# EasyEDA Pro project computerFanControllor.eprj

# Schematic Schematic1
Create Date: 2023-01-05; Page Name: P1; Project Name: computerFanControllor; Schematic Name: Schematic1; Update Date: 2023-01-08; Company: 嘉立创EDA; Page Size: A4; Version: V1.0
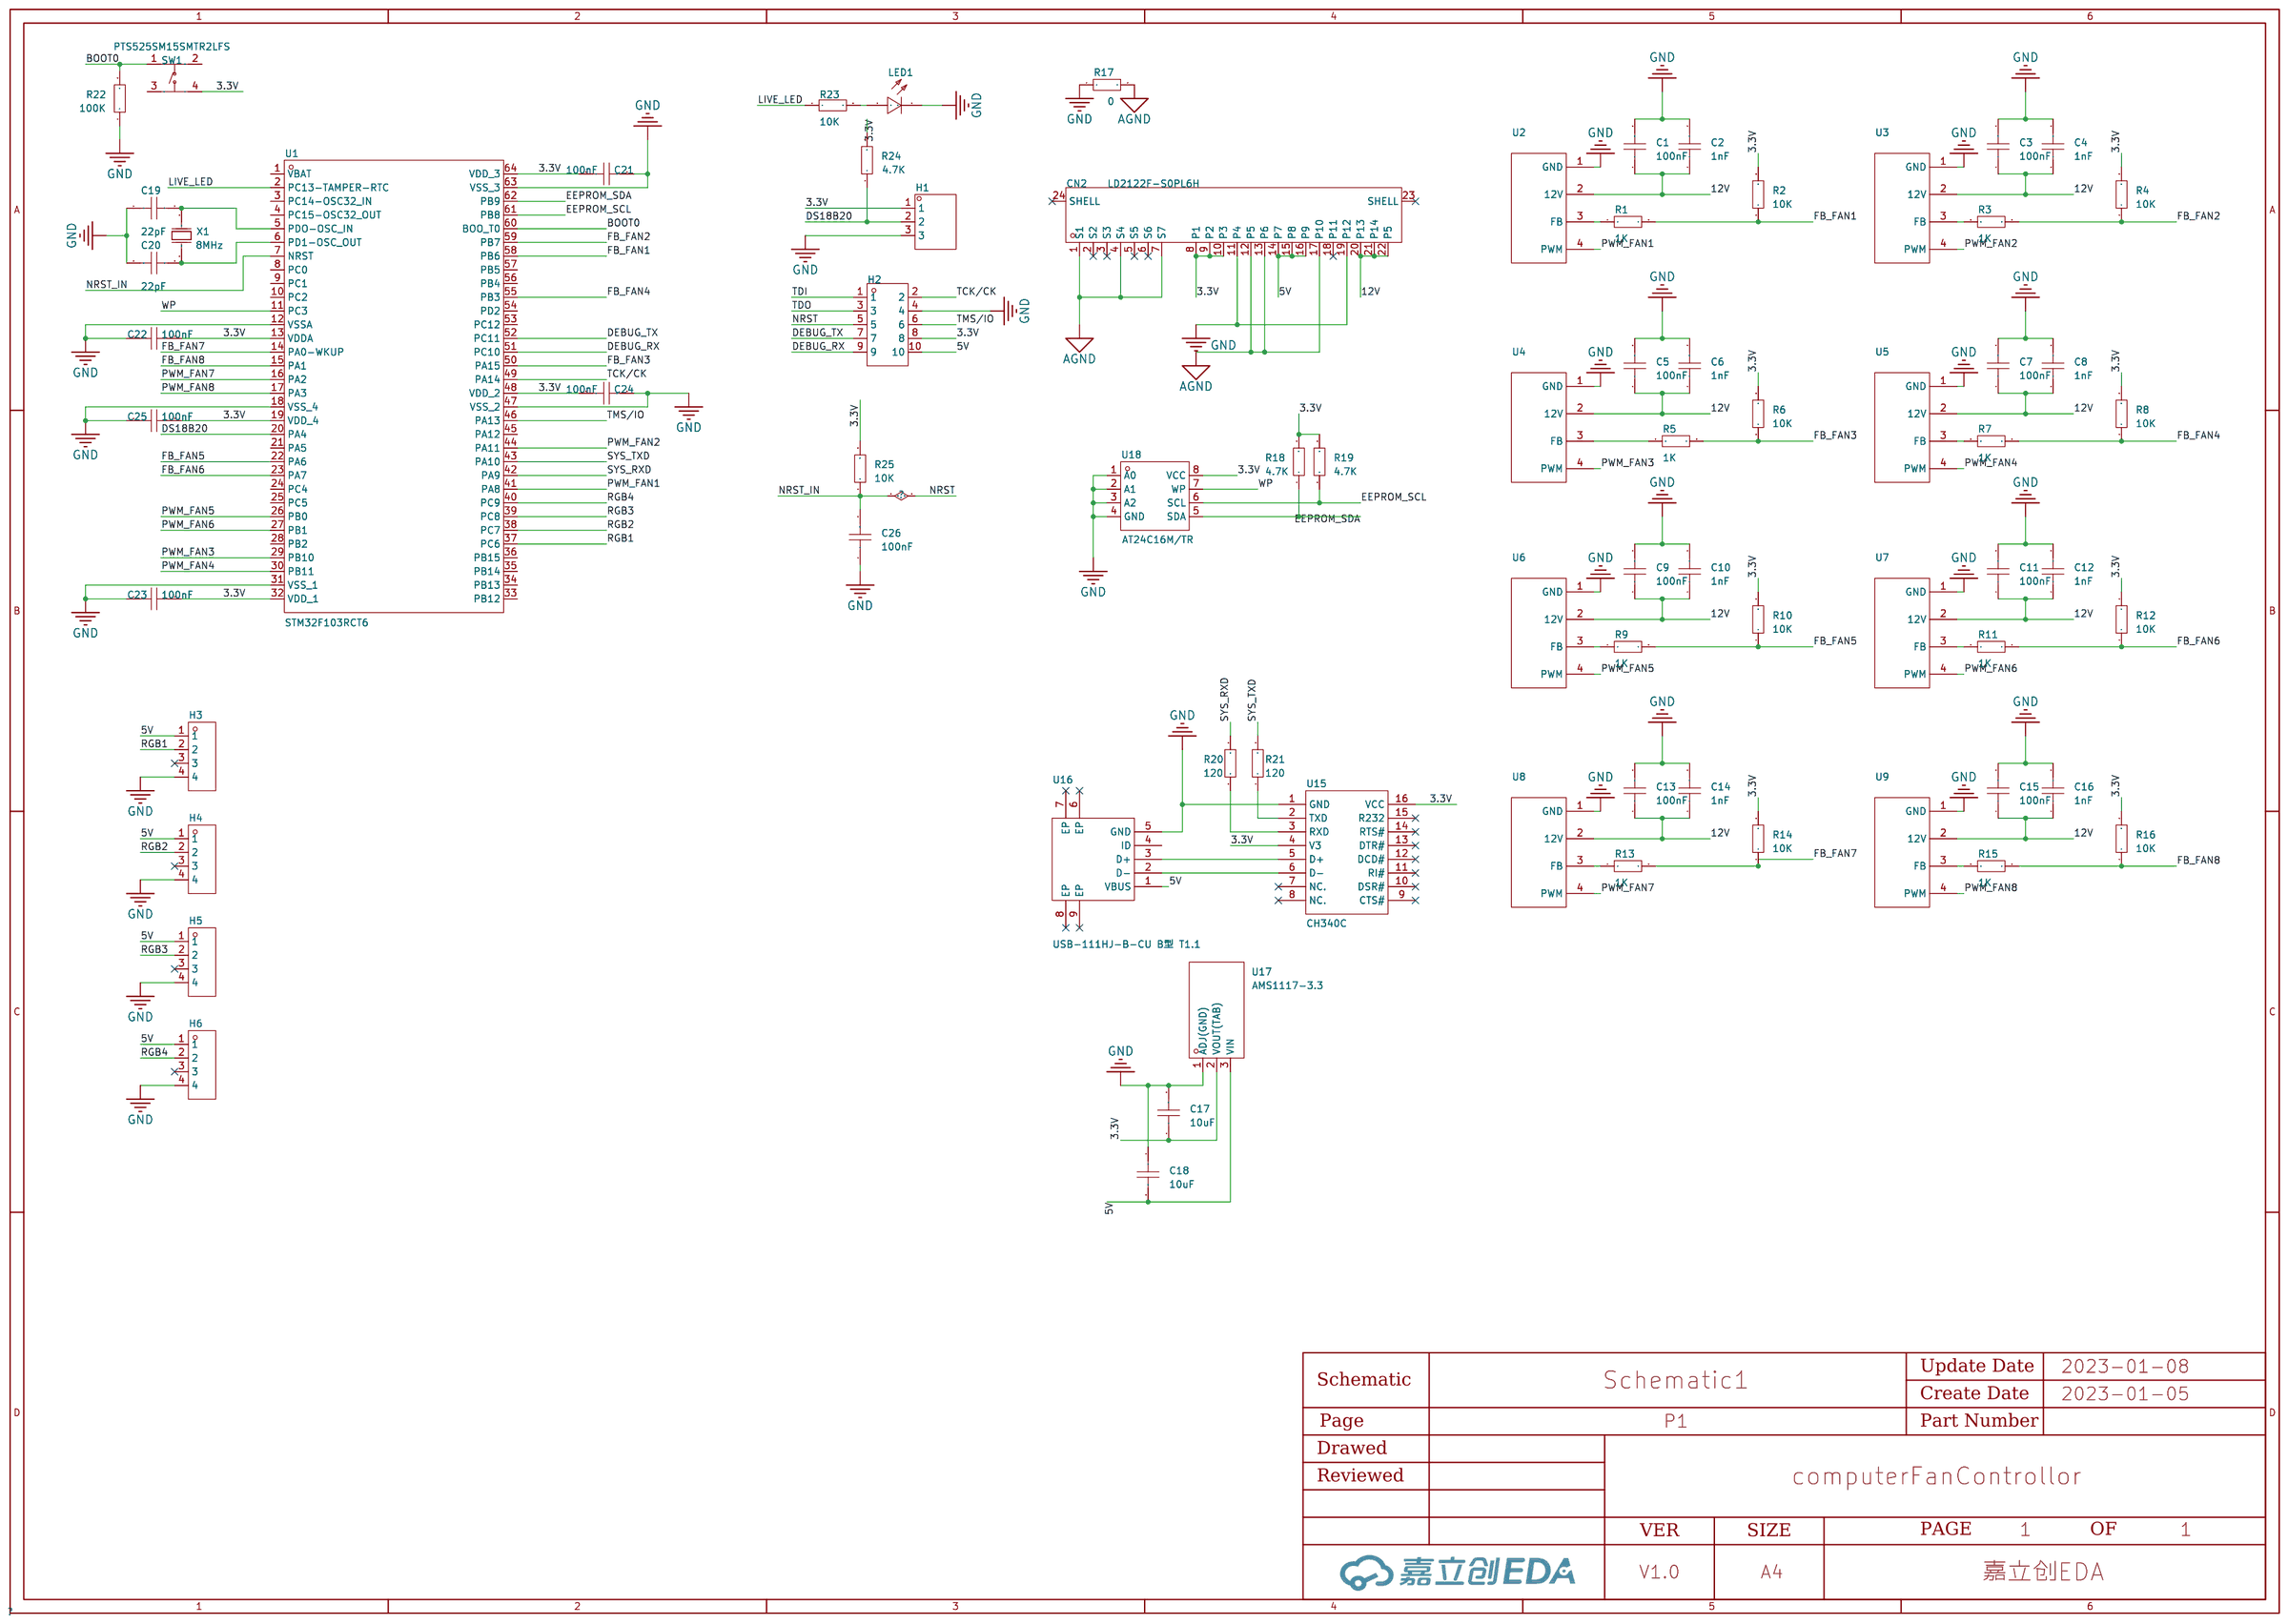
[diagram p0: schematic sheet]

## Parts
C1  100nF  [C0603]
C2  1nF  [C0603]
C3  100nF  [C0603]
C4  1nF  [C0603]
C5  100nF  [C0603]
C6  1nF  [C0603]
C7  100nF  [C0603]
C8  1nF  [C0603]
C9  100nF  [C0603]
C10  1nF  [C0603]
C11  100nF  [C0603]
C12  1nF  [C0603]
C13  100nF  [C0603]
C14  1nF  [C0603]
C15  100nF  [C0603]
C16  1nF  [C0603]
C17  10uF  [C0603]
C18  10uF  [C0603]
C19  22pF  [C0603]
C20  22pF  [C0603]
C21  100nF  [C0603]
C22  100nF  [C0603]
C23  100nF  [C0603]
C24  100nF  [C0603]
C25  100nF  [C0603]
C26  100nF  [C0603]
CN2  LD2122F-S0PL6H  [CONN-SMD_LD2122F-S0PL6H]
H1  77311-102-03LF  [HDR-TH_3P-P2.54-V-M-1]
H2  PZ200-2-05-W  [HDR-TH_10P-P2.00-H-M-R2-C5-S2.00-W9.4-N]
H3  KH-2PH90-1X4P-L10.5  [HDR-TH_4P-P2.00-H-M-W7.2-N]
H4  KH-2PH90-1X4P-L10.5  [HDR-TH_4P-P2.00-H-M-W7.2-N]
H5  KH-2PH90-1X4P-L10.5  [HDR-TH_4P-P2.00-H-M-W7.2-N]
H6  KH-2PH90-1X4P-L10.5  [HDR-TH_4P-P2.00-H-M-W7.2-N]
LED1  19-213/Y2C-CQ2R2L/3T(CY)  [LED0603-R-RD]
R1  1K  [R0603]
R2  10K  [R0603]
R3  1K  [R0603]
R4  10K  [R0603]
R5  1K  [R0603]
R6  10K  [R0603]
R7  1K  [R0603]
R8  10K  [R0603]
R9  1K  [R0603]
R10  10K  [R0603]
R11  1K  [R0603]
R12  10K  [R0603]
R13  1K  [R0603]
R14  10K  [R0603]
R15  1K  [R0603]
R16  10K  [R0603]
R17  0  [R0603]
R18  4.7K  [R0603]
R19  4.7K  [R0603]
R20  120  [R0603]
R21  120  [R0603]
R22  100K  [R0603]
R23  10K  [R0603]
R24  4.7K  [R0603]
R25  10K  [R0603]
SW1  PTS525SM15SMTR2LFS  [KEY-SMD_4P-L5.2-W5.2-P3.80-LS6.2]
U1  STM32F103RCT6  [LQFP-64_L10.0-W10.0-P0.50-LS12.0-BL]
U2  fanConnect  [4Pin风扇接口]
U3  fanConnect  [4Pin风扇接口]
U4  fanConnect  [4Pin风扇接口]
U5  fanConnect  [4Pin风扇接口]
U6  fanConnect  [4Pin风扇接口]
U7  fanConnect  [4Pin风扇接口]
U8  fanConnect  [4Pin风扇接口]
U9  fanConnect  [4Pin风扇接口]
U15  CH340C  [SOP-16_L10.0-W3.9-P1.27-LS6.0-BL]
U16  USB-111HJ-B-CU B型 T1.1  [MICRO-USB-SMD_USB-111HJ]
U17  AMS1117-3.3  [SOT-89_L4.5-W2.5-P1.50-LS4.2-BR]
U18  AT24C16M/TR  [SOP-8_L4.9-W3.9-P1.27-LS6.0-BL]
X1  8MHz  [CRYSTAL-SMD_L11.5-W4.8-LS12.7]

## Library data of the parts
C1-C26 = CAP_0603: Supplier Footprint: 0603
CN2 = LD2122F-S0PL6H: 连接器类型:SATA;间距:1.27mm;引脚总数:22;安装方式:-;工作温度范围:-55℃~+85℃;; LCSC Part Name: SATA 1.27mm P数:22; Supplier Part: C2761452; Manufacturer: FOXCONN(富士康); Supplier Footprint: SMD,P=1.27mm; JLCPCB Part Class: 扩展库; Datasheet: https://atta.szlcsc.com/upload/public/pdf/source/20210616/C2761452_F794E7D3312EF9E45FEB3BC38FC6E199.pdf; Supplier: LCSC; Connector Type: SATA; Pitch: 1.27mm; Number of Pins: 22; Operating Temperature Range: -55℃~+85℃
H1 = 77311-102-03LF: 间距:2.54mm;总PIN位数:-;排数:1;插针结构:-;行距:-;安装类型:直插;圆针/方针:方针;额定电流:-;额定电压:-;配合针长度:-;塑高:2.54mm;触头材质:磷青铜;触头镀层:-;颜色:黑色;; LCSC Part Name: 2.54mm 直插 方针; Supplier Part: C180248; Manufacturer: Amphenol; Supplier Footprint: 直插,P=2.54mm; JLCPCB Part Class: 扩展库; Datasheet: https://atta.szlcsc.com/upload/public/pdf/source/20180329/C180248_62E264527695F7ED58561BB828D45E42.pdf; Supplier: LCSC; Pitch: 2.54mm; Number of Rows: 1; Mounting Type: 直插; Circluar Pins/Square Pins: 方针; Insulation Height: 2.54mm; Contact Material: 磷青铜; Color: 黑色
H2 = PZ200-2-05-W: 排数:双排;总PIN位数:10;间距:2mm;插针结构:2x5P;行距:2mm;安装类型:弯插;圆针/方针:方针;额定电流:1.5A;额定电压:-;配合针长度:4mm;塑高:2mm;端接针长度:-;工作温度范围:-40℃~+105℃;颜色:黑色;; LCSC Part Name: 2mm 2x5P 弯插 方针; Supplier Part: C2906011; Manufacturer: HCTL(华灿天禄); Supplier Footprint: 弯插,P=2mm; JLCPCB Part Class: 扩展库; Datasheet: https://atta.szlcsc.com/upload/public/pdf/source/20211108/98DBA505CA87D832D47F3B9CD8D66D87.pdf; Supplier: LCSC; Number of Rows: 双排; Number of Pins: 10; Pitch: 2mm; Pin Structure: 2x5P; Row Spacing: 2mm; Mounting Type: 弯插; Circluar Pins/Square Pins: 方针; Current Rating (Max): 1.5A; Length of Mating Pin: 4mm; Insulation Height: 2mm; Operating Temperature Range: -40℃~+105℃; Color: 黑色
H3-H6 = KH-2PH90-1X4P-L10.5: 排数:单排;总PIN位数:4;间距:2mm;插针结构:1x4P;行距:-;安装类型:弯插;圆针/方针:方针;额定电流:1.5A;额定电压:-;配合针长度:4mm;塑高:2mm;端接针长度:-;工作温度范围:-40℃~+105℃;颜色:-;; LCSC Part Name: 2mm 1x4P 弯插 方针; Supplier Part: C2938466; Manufacturer: kinghelm(金航标); Supplier Footprint: 弯插,P=2mm; JLCPCB Part Class: 扩展库; Datasheet: https://atta.szlcsc.com/upload/public/pdf/source/20211228/35E289205D7989E3A1EB85130EECF70E.pdf; Supplier: LCSC; Number of Rows: 单排; Number of Pins: 4; Pitch: 2mm; Pin Structure: 1x4P; Mounting Type: 弯插; Circluar Pins/Square Pins: 方针; Current Rating (Max): 1.5A; Length of Mating Pin: 4mm; Insulation Height: 2mm; Operating Temperature Range: -40℃~+105℃
LED1 = 19-213/Y2C-CQ2R2L/3T(CY): 发光颜色:黄灯;二极管配置:-;透镜颜色:无色透明;主波长:585.5nm~591.5nm;峰值波长:591nm;色温:-;测试电流:20mA;功率:60mW;发光角度:120°;安装方式:-;工作温度:-40℃~+85℃;; LCSC Part Name: 黄灯 585.5nm~591.5nm; Supplier Part: C72038; Manufacturer: EVERLIGHT(亿光); Supplier Footprint: 0603; JLCPCB Part Class: 基础库; Datasheet: https://atta.szlcsc.com/upload/public/pdf/source/20160507/1462613613586.pdf; Supplier: LCSC; Emitted Color: 黄灯; Lens Color: 无色透明; Dominant Wavelength: 585.5nm~591.5nm; Peak Wavelength: 591nm; Forward Current: 20mA; Power Dissipation: 60mW; Viewing Angle: 120°; Operating Temperature: -40℃~+85℃
R1-R25 = Res_0603: Supplier Footprint: 0603
SW1 = PTS525SM15SMTR2LFS: 触点电流:20mA;额定电压(DC):15V;电路结构:单刀单掷;安装方式:立贴;按钮形状:圆形按钮;带灯:-;开关长度:5.2mm;开关宽度:5.2mm;开关高度:1.5mm;; Supplier Part: C221856; Manufacturer: C&K; Supplier Footprint: SMD,5.2x5.2x1.5mm; JLCPCB Part Class: 扩展库; Datasheet: https://atta.szlcsc.com/upload/public/pdf/source/20180724/C221856_01736BD75CF757B4331614777C6086B7.pdf; Supplier: LCSC; Contact Current: 20mA; Voltage Rating (DC): 15V; Circuit: 单刀单掷; Mounting Style: 立贴; Actuator Style: 圆形按钮; Switch Length: 5.2mm; Switch Width: 5.2mm; Switch Height: 1.5mm
U1 = STM32F103RCT6: CPU内核:ARM Cortex-M3;CPU最大主频:72MHz;工作电压范围:2V~3.6V;内部振荡器:有;程序 FLASH容量:256K@x8bit;RAM总容量:48KB;EEPROM/数据 FLASH容量:-;GPIO端口数量:51;ADC(单元数/通道数/位数):1@x16ch/12bit;DAC(单元数/通道数/位数):1@x2ch/12bit;外设/功能/协议栈:温度传感器；DMA；看门狗；POR；PWM;工作温度范围:-40℃~+85℃;; LCSC Part Name: ARM Cortex-M3 72MHz 闪存：256K@x8bit RAM：48KB; Supplier Part: C8323; Manufacturer: ST(意法半导体); Supplier Footprint: LQFP-64(10x10); JLCPCB Part Class: 扩展库; Datasheet: https://atta.szlcsc.com/upload/public/pdf/source/20161130/1480498797345.pdf; Supplier: LCSC; CPU Core: ARM Cortex-M3; Maximum Frequency: 72MHz; Supply Voltage Range: 2V~3.6V; Internal Oscillator: 有; Program FLASH Size: 256K@x8bit; RAM Size: 48KB; GPIO Ports Number: 51; ADC (Units/Channels/bits): 1@x16ch/12bit; DAC (Units/Channels/bits): 1@x2ch/12bit; Peripherals / Functions / Protocol Stacks: 温度传感器；DMA；看门狗；POR；PWM; Operating Temperature Range: -40℃~+85℃
U2-U9 = 4pin风扇接口
U15 = CH340C: 应用功能:Transceiver;接口协议:USB 2.0;数据速率:2Mbps;供电电压:3.3V；5V;; Supplier Part: C84681; Manufacturer: WCH(南京沁恒); Supplier Footprint: SOP-16; JLCPCB Part Class: 扩展库; Datasheet: https://atta.szlcsc.com/upload/public/pdf/source/20200819/C84681_ADBED554CE321879DBD6B1D06488689C.pdf; Supplier: LCSC; Applications Function: Transceiver; Protocol: USB 2.0; Data Rate: 2Mbps; Supply Voltage: 3.3V；5V
U16 = USB-111HJ-B-CU B型 T1.1: 连接器类型:Micro-B;标准:-;公母:母座;触点数量:5;端口数量:1;安装方式:卧贴;额定电流 - 电源:-;工作温度范围:-;; LCSC Part Name: Micro-B 母座 卧贴; Supplier Part: C2939567; Manufacturer: HOOYA(皓宇电子); Supplier Footprint: SMD; Datasheet: https://atta.szlcsc.com/upload/public/pdf/source/20220211/7A17012C7321BAFDD991CA56D4ADA811.pdf; Supplier: LCSC; Connector Type: Micro-B; Gender: 母座; Number of Contacts: 5; Number of Ports: 1; Mounting Style: 卧贴
U17 = AMS1117-3.3_C347256: 压降(max):1.3V @ 1A;输出电压(可调):-;静态电流(Iq):-;最大输入电压:18V;输出类型:固定;输出电压(固定):3.3V;; LCSC Part Name: 低压差线性稳压(LDO); Supplier Part: C347256; Manufacturer: UMW(友台半导体); Supplier Footprint: SOT-89; JLCPCB Part Class: 扩展库; Datasheet: https://atta.szlcsc.com/upload/public/pdf/source/20181218/C347256_B950D326C9965069E1D136423D8C1DAA.pdf; Supplier: LCSC
U18 = AT24C16M/TR: Supplier Part: C356701; Manufacturer: HGSEMI(华冠); Supplier Footprint: SOP-8; JLCPCB Part Class: 扩展库; Datasheet: https://atta.szlcsc.com/upload/public/pdf/source/20220714/5A9938374CA1B0C07A427C61968786F5.pdf; Supplier: LCSC
X1 = X49SM8MSD2SC: 晶振类型:49SMD;频率:8MHz;频率公差:±20ppm;频率稳定度:±30ppm;负载电容:20pF;工作温度:-20℃~+70℃;; LCSC Part Name: HC-49SMD 8MHz ±20ppm 20pF; Supplier Part: C12674; Manufacturer: YXC(扬兴晶振); Supplier Footprint: HC-49S-SMD-2P; JLCPCB Part Class: 基础库; Datasheet: https://atta.szlcsc.com/upload/public/pdf/source/20210329/C106809_0E91E60850A780B284B63D653DC40EA4.pdf; Supplier: LCSC; Crystal Type: 49SMD; Frequency Tolerance: ±20ppm; Frequency Stability: ±30ppm; Load Capacitance: 20pF; Operating Temperature: -20℃~+70℃

## Nets
3.3V: C17.1 C21.1 C22.2 C23.2 C24.1 C25.2 CN2.8(P1) CN2.9(P2) CN2.10(P3) H1.1 H2.8 R2.2 R4.2 R6.2 R8.2 R10.2 R12.2 R14.2 R16.2 R18.2 R19.2 R24.2 R25.2 SW1.4 U1.13(VDDA) U1.19(VDD_4) U1.32(VDD_1) U1.48(VDD_2) U1.64(VDD_3) U15.4(V3) U15.16(VCC) U17.2(VOUT(TAB)) U18.8(VCC)
5V: C18.2 CN2.14(P7) CN2.15(P8) CN2.16(P9) H2.10 H3.1 H4.1 H5.1 H6.1 U16.1(VBUS) U17.3(VIN)
12V: C1.1 C2.1 C3.1 C4.1 C5.1 C6.1 C7.1 C8.1 C9.1 C10.1 C11.1 C12.1 C13.1 C14.1 C15.1 C16.1 CN2.20(P13) CN2.21(P14) CN2.22(P5) U2.2(12V) U3.2(12V) U4.2(12V) U5.2(12V) U6.2(12V) U7.2(12V) U8.2(12V) U9.2(12V)
AGND: CN2.1(S1) CN2.4(S4) CN2.7(S7) CN2.12(P5) CN2.13(P6) CN2.17(P10) R17.2
GND: C1.2 C2.2 C3.2 C4.2 C5.2 C6.2 C7.2 C8.2 C9.2 C10.2 C11.2 C12.2 C13.2 C14.2 C15.2 C16.2 C17.2 C18.1 C19.1 C20.1 C21.2 C22.1 C23.1 C24.2 C25.1 C26.1 CN2.11(P4) CN2.19(P12) H1.3 H2.4 H3.4 H4.4 H5.4 H6.4 LED1.2(C) R17.1 R22.1 U1.12(VSSA) U1.18(VSS_4) U1.31(VSS_1) U1.47(VSS_2) U1.63(VSS_3) U2.1(GND) U3.1(GND) U4.1(GND) U5.1(GND) U6.1(GND) U7.1(GND) U8.1(GND) U9.1(GND) U15.1(GND) U16.5(GND) U17.1(ADJ(GND)) U18.1(A0) U18.2(A1) U18.3(A2) U18.4(GND)
BOOT0: R22.2 SW1.1 U1.60(BOO_T0)
DEBUG_RX: H2.9 U1.51(PC10)
DEBUG_TX: H2.7 U1.52(PC11)
DS18B20: H1.2 R24.1 U1.20(PA4)
EEPROM_SCL: R19.1 U1.61(PB8) U18.6(SCL)
EEPROM_SDA: R18.1 U1.62(PB9) U18.5(SDA)
FB_FAN1: R1.2 R2.1 U1.58(PB6)
FB_FAN2: R3.2 R4.1 U1.59(PB7)
FB_FAN3: R5.2 R6.1 U1.50(PA15)
FB_FAN4: R7.2 R8.1 U1.55(PB3)
FB_FAN5: R9.2 R10.1 U1.22(PA6)
FB_FAN6: R11.2 R12.1 U1.23(PA7)
FB_FAN7: R13.2 R14.1 U1.14(PA0-WKUP)
FB_FAN8: R15.2 R16.1 U1.15(PA1)
LIVE_LED: R23.1 U1.2(PC13-TAMPER-RTC)
NRST: C26.2 H2.5 R25.1 U1.7(NRST)
PWM_FAN1: U1.41(PA8) U2.4(PWM)
PWM_FAN2: U1.44(PA11) U3.4(PWM)
PWM_FAN3: U1.29(PB10) U4.4(PWM)
PWM_FAN4: U1.30(PB11) U5.4(PWM)
PWM_FAN5: U1.26(PB0) U6.4(PWM)
PWM_FAN6: U1.27(PB1) U7.4(PWM)
PWM_FAN7: U1.16(PA2) U8.4(PWM)
PWM_FAN8: U1.17(PA3) U9.4(PWM)
RGB1: H3.2 U1.37(PC6)
RGB2: H4.2 U1.38(PC7)
RGB3: H5.2 U1.39(PC8)
RGB4: H6.2 U1.40(PC9)
SYS_RXD: R20.2 U1.42(PA9)
SYS_TXD: R21.2 U1.43(PA10)
TCK/CK: H2.2 U1.49(PA14)
TDI: H2.1
TDO: H2.3
TMS/IO: H2.6 U1.46(PA13)
WP: U1.11(PC3) U18.7(WP)
$1N3735: R1.1 U2.3(FB)
$1N4374: R3.1 U3.3(FB)
$1N5683: R5.1 U4.3(FB)
$1N5690: R7.1 U5.3(FB)
$1N10521: R9.1 U6.3(FB)
$1N10528: R11.1 U7.3(FB)
$1N10535: R13.1 U8.3(FB)
$1N10542: R15.1 U9.3(FB)
$1N19138: U15.5(D+) U16.3(D+)
$1N19241: U15.6(D-) U16.2(D-)
$1N20833: R20.1 U15.3(RXD)
$1N20835: R21.1 U15.2(TXD)
$1N25627: C19.2 U1.5(PDO-OSC_IN) X1.1(OSC1)
$1N25686: C20.2 U1.6(PD1-OSC_OUT) X1.2(OSC2)
$1N30814: LED1.1(A) R23.2

Not connected (* = marked no-connect by the designer): CN2 2(S2)* 3(S3)* 5(S5)* 6(S6)* 18(P11)* 23(SHELL)* 24(SHELL)*; H3 3*; H4 3*; H5 3*; H6 3*; SW1 2 3; U1 1(VBAT) 3(PC14-OSC32_IN) 4(PC15-OSC32_OUT) 8(PC0) 9(PC1) 10(PC2) 21(PA5) 24(PC4) 25(PC5) 28(PB2) 33(PB12) 34(PB13) 35(PB14) 36(PB15) 45(PA12) 53(PC12) 54(PD2) 56(PB4) 57(PB5); U15 7(NC.)* 8(NC.)* 9(CTS#)* 10(DSR#)* 11(RI#)* 12(DCD#)* 13(DTR#)* 14(RTS#)* 15(R232)*; U16 4(ID) 6(EP)* 7(EP)* 8(EP)* 9(EP)*

# Board PCB1
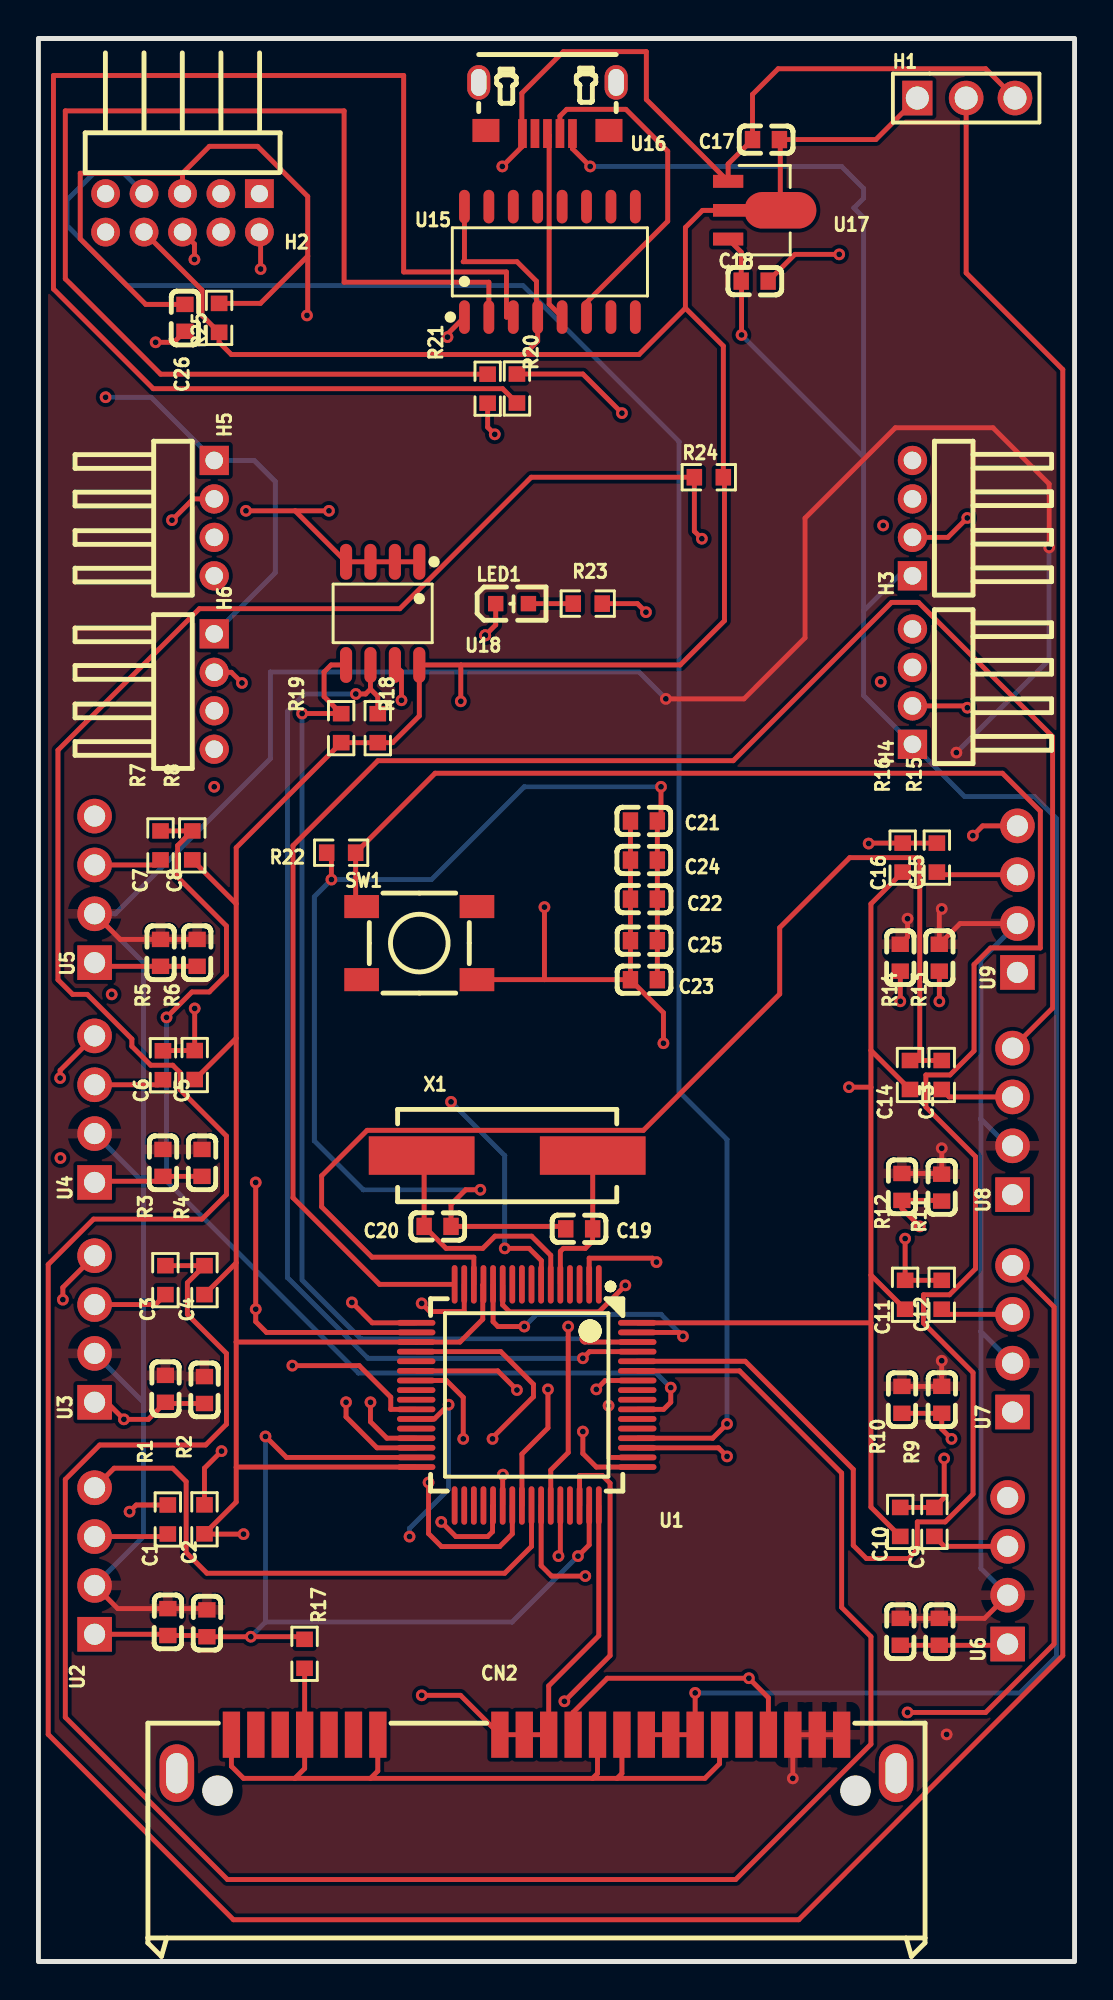
[diagram p1: board, top side]
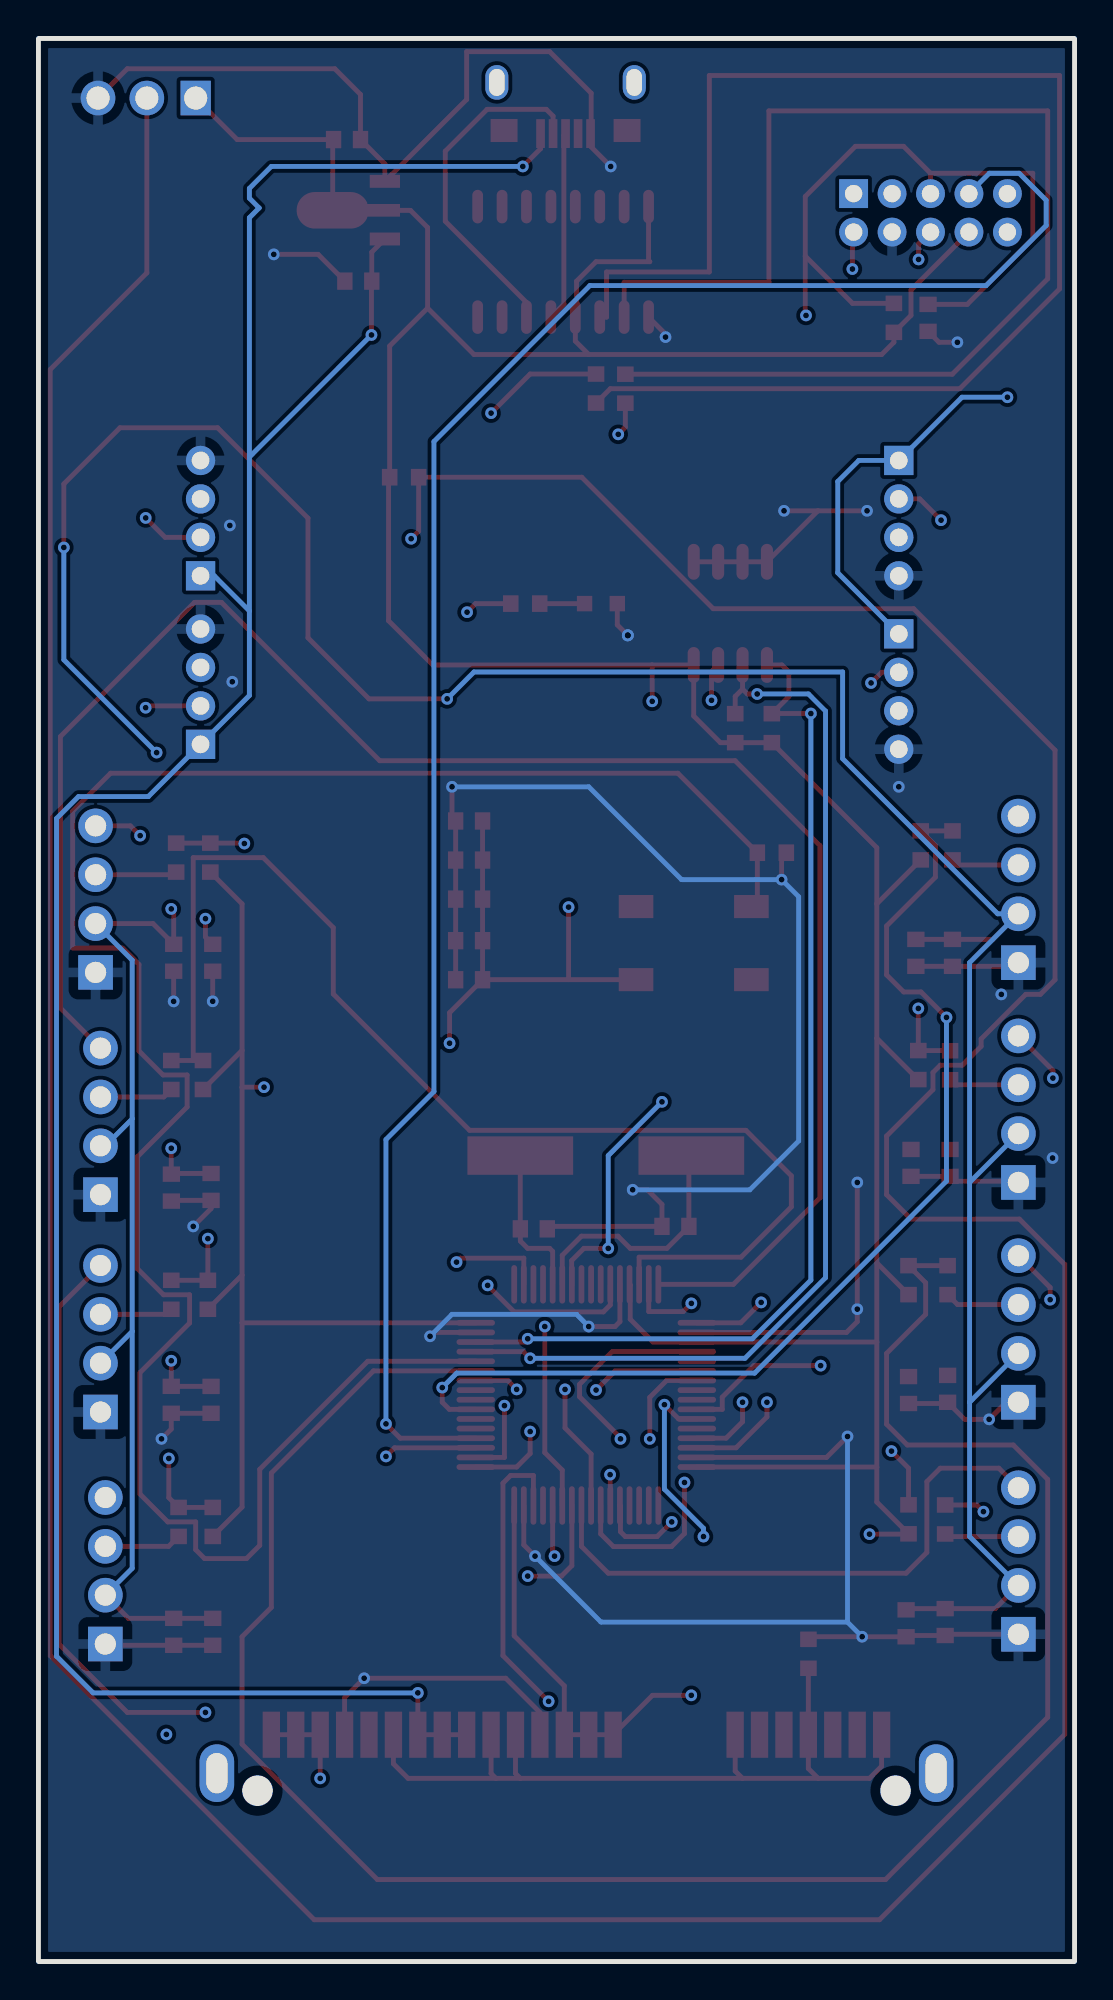
[diagram p2: board, bottom side, seen from below]

Outline 53.9 x 100 mm; copper layers: Top Layer, Inner1, Inner2, Bottom Layer. Coordinates in mm from the lower left corner of the outline.
Outline path: rectangle 0,100 53.9,0
Stack: Top Layer 0.035mm / Dielectric1 0.48mm PP er 4.5 / Inner1 0.035mm / Dielectric2 0.48mm FR4 er 4.5 / Inner2 0.035mm / Dielectric3 0.48mm PP er 4.5 / Bottom Layer 0.035mm

## Design rules (mm)
spacing safeClearance (default): track to track 0.089, other pairs 0.1 to 0.3
track width trackWidth (default): min 0.102, default 0.254, max 2.54
differential pair differentialPair (default): width min 0.127, default 0.254, max 2.54; gap min 0.152, default 0.152
via viaSize (default): diameter min 0.25, default 0.61, max 10; hole min 0.15, default 0.305, max 6

## Placement (name value [footprint] x y rotation side)
C1  100nF  [C0603]  6.73 17.65 270 top
C2  1nF  [C0603]  8.76 17.59 270 top
C3  100nF  [C0603]  6.6 29.78 270 top
C4  1nF  [C0603]  8.64 29.72 270 top
C5  100nF  [C0603]  8.51 41.53 270 top
C6  1nF  [C0603]  6.48 41.53 270 top
C7  100nF  [C0603]  6.35 52.45 270 top
C8  1nF  [C0603]  8.25 52.45 270 top
C9  100nF  [C0603]  46.86 17.15 270 top
C10  1nF  [C0603]  44.83 17.15 270 top
C11  100nF  [C0603]  44.92 29.21 270 top
C12  1nF  [C0603]  46.99 29.21 270 top
C13  100nF  [C0603]  46.98 40.24 270 top
C14  1nF  [C0603]  44.92 40.28 270 top
C15  100nF  [C0603]  46.86 52.2 270 top
C16  1nF  [C0603]  44.83 52.2 270 top
C17  10uF  [C0603]  37.85 94.74 180 top
C18  10uF  [C0603]  37.26 87.38 180 top
C19  22pF  [C0603]  28.13 38.1 0 top
C20  22pF  [C0603]  20.76 38.23 180 top
C21  100nF  [C0603]  31.5 59.31 0 top
C22  100nF  [C0603]  31.5 55.25 180 top
C23  100nF  [C0603]  31.5 51.05 180 top
C24  100nF  [C0603]  31.5 57.28 0 top
C25  100nF  [C0603]  31.5 53.09 180 top
C26  100nF  [C0603]  7.62 85.47 90 top
CN2  LD2122F-S0PL6H  [CONN-SMD_LD2122F-S0PL6H]  25.91 10.8 0 top
H1  77311-102-03LF  [HDR-TH_3P-P2.54-V-M-1]  48.26 96.9 0 top
H2  PZ200-2-05-W  [HDR-TH_10P-P2.00-H-M-R2-C5-S2.00-W9.4-N]  7.49 90.93 180 top
H3  KH-2PH90-1X4P-L10.5  [HDR-TH_4P-P2.00-H-M-W7.2-N]  45.47 75.06 90 top
H4  KH-2PH90-1X4P-L10.5  [HDR-TH_4P-P2.00-H-M-W7.2-N]  45.47 66.29 90 top
H5  KH-2PH90-1X4P-L10.5  [HDR-TH_4P-P2.00-H-M-W7.2-N]  9.14 75.06 270 top
H6  KH-2PH90-1X4P-L10.5  [HDR-TH_4P-P2.00-H-M-W7.2-N]  9.14 66.04 270 top
LED1  19-213/Y2C-CQ2R2L/3T(CY)  [LED0603-R-RD]  24.64 70.61 0 top
R1  1K  [R0603]  6.73 22.99 90 top
R2  10K  [R0603]  8.64 23 270 top
R3  1K  [R0603]  6.6 35.43 90 top
R4  10K  [R0603]  8.64 35.43 270 top
R5  1K  [R0603]  6.48 46.61 90 top
R6  10K  [R0603]  8.13 46.62 270 top
R7  1K  [R0603]  6.35 58.04 90 top
R8  10K  [R0603]  8 58.04 270 top
R9  1K  [R0603]  46.61 22.86 90 top
R10  10K  [R0603]  44.83 22.86 270 top
R11  1K  [R0603]  46.99 34.67 90 top
R12  10K  [R0603]  45.08 34.67 270 top
R13  1K  [R0603]  46.99 46.1 90 top
R14  10K  [R0603]  45.34 46.1 270 top
R15  1K  [R0603]  46.74 57.4 90 top
R16  10K  [R0603]  44.96 57.4 270 top
R17  0  [R0603]  13.84 16 270 top
R18  4.7K  [R0603]  15.75 64.14 270 top
R19  4.7K  [R0603]  17.65 64.14 270 top
R20  120  [R0603]  24.89 81.8 90 top
R21  120  [R0603]  23.37 81.79 270 top
R22  100K  [R0603]  15.75 57.66 0 top
R23  10K  [R0603]  28.58 70.61 180 top
R24  4.7K  [R0603]  34.87 77.18 0 top
R25  10K  [R0603]  9.4 85.47 270 top
SW1  PTS525SM15SMTR2LFS  [KEY-SMD_4P-L5.2-W5.2-P3.80-LS6.2]  19.81 52.96 0 top
U1  STM32F103RCT6  [LQFP-64_L10.0-W10.0-P0.50-LS12.0-BL]  25.4 29.46 180 top
U2  fanConnect  [4Pin风扇接口]  2.92 17.02 90 top
U3  fanConnect  [4Pin风扇接口]  2.92 29.08 90 top
U4  fanConnect  [4Pin风扇接口]  2.92 40.51 90 top
U5  fanConnect  [4Pin风扇接口]  2.92 51.94 90 top
U6  fanConnect  [4Pin风扇接口]  50.42 16.51 90 top
U7  fanConnect  [4Pin风扇接口]  50.67 28.58 90 top
U8  fanConnect  [4Pin风扇接口]  50.67 39.88 90 top
U9  fanConnect  [4Pin风扇接口]  50.93 51.44 90 top
U15  CH340C  [SOP-16_L10.0-W3.9-P1.27-LS6.0-BL]  26.61 88.38 0 top
U16  USB-111HJ-B-CU B型 T1.1  [MICRO-USB-SMD_USB-111HJ]  26.48 96.38 180 top
U17  AMS1117-3.3  [SOT-89_L4.5-W2.5-P1.50-LS4.2-BR]  37.23 91.07 180 top
U18  AT24C16M/TR  [SOP-8_L4.9-W3.9-P1.27-LS6.0-BL]  17.91 70.1 180 top
X1  8MHz  [CRYSTAL-SMD_L11.5-W4.8-LS12.7]  24.38 41.91 180 top

## Footprints (pads in the part's own frame, mm; a bottom-side part is the same pattern mirrored in y, then rotated)
4Pin风扇接口
  rect 1.801x1.801 hole 1.1: 1(0,0)
  round 1.801 hole 1.1: 2(2.54,0) 3(5.08,0) 4(7.62,0)
C0603
  rect 0.8x0.9 smd: 1(-0.7,0) 2(0.7,0)
CONN-SMD_LD2122F-S0PL6H
  rect 0.9x2.4 smd: 1(-15.87,1) 2(-14.6,1) 3(-13.33,1) 4(-12.06,1) 5(-10.79,1) 6(-9.52,1) 7(-8.25,1) 8(-1.905,1) 9(-0.635,1) 10(0.635,1) 11(1.905,1) 12(3.175,1) 13(4.445,1) 14(5.715,1) 15(6.985,1) 16(8.255,1) 17(9.525,1) 18(10.795,1) 19(12.065,1) 20(13.335,1) 21(14.605,1) 22(15.875,1)
  oval 1.8x3 hole 1.1x2.1: 23(-18.71,-1) 24(18.71,-1)
CRYSTAL-SMD_L11.5-W4.8-LS12.7
  rect 5.499x1.999 smd: 1(-4.45,0) 2(4.45,0)
HDR-TH_3P-P2.54-V-M-1
  rect 1.575x1.801 hole 1.199: 1(-2.54,0)
  round 1.801 hole 1.199: 2(0,0) 3(2.54,0)
HDR-TH_4P-P2.00-H-M-W7.2-N
  rect 1.524x1.524 hole 0.914: 1(-3,0)
  round 1.524 hole 0.914: 2(-1,0) 3(1,0) 4(3,0)
HDR-TH_10P-P2.00-H-M-R2-C5-S2.00-W9.4-N
  rect 1.5x1.5 hole 0.9: 1(-4,-1)
  round 1.5 hole 0.9: 2(-4,1) 3(-2,-1) 4(-2,1) 5(0,-1) 6(0,1) 7(2,-1) 8(2,1) 9(4,-1) 10(4,1)
KEY-SMD_4P-L5.2-W5.2-P3.80-LS6.2
  rect 1.8x1.2 smd: 1(-3,1.9) 2(3,1.9) 3(-3,-1.9) 4(3,-1.9)
LED0603-R-RD
  rect 0.8x0.8 smd: 1(0.851,0) 2(-0.851,0)
LQFP-64_L10.0-W10.0-P0.50-LS12.0-BL
  oval 0.3x2 smd: 1(-3.75,-5.75) 2(-3.25,-5.75) 3(-2.75,-5.75) 4(-2.25,-5.75) 5(-1.75,-5.75) 6(-1.25,-5.75) 7(-0.75,-5.75) 8(-0.25,-5.75) 9(0.25,-5.75) 10(0.75,-5.75) 11(1.25,-5.75) 12(1.75,-5.75) 13(2.25,-5.75) 14(2.75,-5.75) 15(3.25,-5.75) 16(3.75,-5.75) 33(3.75,5.75) 34(3.25,5.75) 35(2.75,5.75) 36(2.25,5.75) 37(1.75,5.75) 38(1.25,5.75) 39(0.75,5.75) 40(0.25,5.75) 41(-0.25,5.75) 42(-0.75,5.75) 43(-1.25,5.75) 44(-1.75,5.75) 45(-2.25,5.75) 46(-2.75,5.75) 47(-3.25,5.75) 48(-3.75,5.75)
  oval 2x0.3 smd: 17(5.75,-3.75) 18(5.75,-3.25) 19(5.75,-2.75) 20(5.75,-2.25) 21(5.75,-1.75) 22(5.75,-1.25) 23(5.75,-0.75) 24(5.75,-0.25) 25(5.75,0.25) 26(5.75,0.75) 27(5.75,1.25) 28(5.75,1.75) 29(5.75,2.25) 30(5.75,2.75) 31(5.75,3.25) 32(5.75,3.75) 49(-5.75,3.75) 50(-5.75,3.25) 51(-5.75,2.75) 52(-5.75,2.25) 53(-5.75,1.75) 54(-5.75,1.25) 55(-5.75,0.75) 56(-5.75,0.25) 57(-5.75,-0.25) 58(-5.75,-0.75) 59(-5.75,-1.25) 60(-5.75,-1.75) 61(-5.75,-2.25) 62(-5.75,-2.75) 63(-5.75,-3.25) 64(-5.75,-3.75)
MICRO-USB-SMD_USB-111HJ
  rect 0.45x1.5 smd: 1(-1.3,1.33) 2(-0.65,1.33) 3(0,1.33) 4(0.65,1.33) 5(1.3,1.33)
  rect 1.4x1.2 smd: 6(-3.2,1.17) 7(3.2,1.17)
  oval 1.2x1.8 hole 0.8x1.4: 8(3.575,-1.33) 9(-3.575,-1.33)
R0603
  rect 0.806x0.864 smd: 1(-0.753,0) 2(0.753,0)
SOP-8_L4.9-W3.9-P1.27-LS6.0-BL
  oval 0.63x1.865 smd: 1(-1.905,-2.683) 2(-0.635,-2.683) 3(0.635,-2.683) 4(1.905,-2.683) 5(1.905,2.683) 6(0.635,2.683) 7(-0.635,2.683) 8(-1.905,2.683)
SOP-16_L10.0-W3.9-P1.27-LS6.0-BL
  oval 0.56x1.745 smd: 1(-4.445,-2.873) 2(-3.175,-2.873) 3(-1.905,-2.873) 4(-0.635,-2.873) 5(0.635,-2.873) 6(1.905,-2.873) 7(3.175,-2.873) 8(4.445,-2.873) 9(4.445,2.873) 10(3.175,2.873) 11(1.905,2.873) 12(0.635,2.873) 13(-0.635,2.873) 14(-1.905,2.873) 15(-3.175,2.873) 16(-4.445,2.873)
SOT-89_L4.5-W2.5-P1.50-LS4.2-BR
  rect 1.575x0.673 smd: 1(1.357,-1.498) 3(1.357,1.501)
  custom 5.378x1.9 smd: 2(-1.357,0.007)

## Nets
As in the schematic.

Pads without a net: CN2 2 3 5 6 18 23 24; H3 3; H4 3; H5 3; H6 3; SW1 2 3; U1 1 3 4 8 9 10 21 24 25 28 33 34 35 36 45 53 54 56 57; U15 7 8 9 10 11 12 13 14 15; U16 4 6 7 8 9

## Via types
v1: diameter 0.61, hole 0.305, Top Layer to Bottom Layer, 104 vias

## Routing (per net, layer and track width the routed paths; a pad name or vN(x,y) marks a point on that pad's centre or on a via; arc(x,y) is an arc through that point)
3.3V: length 322.6
  Top Layer w0.254: v1(42.16,45.47) 43.3,45.47 43.31,45.46 ; 43.31,35.7 R12.2 ; 43.31,35.7 43.31,33.21 ; 43.31,35.7 43.31,45.46 ; 10.29,25.7 10.29,23.89 R2.2 8.65,22.22 v1(10.67,22.22) ; 10.29,25.7 10.3,25.71 U1.32 ; 10.29,25.7 10.29,32.21 ; 38.61,94.74 43.56,94.74 45.72,96.9 ; 38.61,94.74 38.55,94.74 ; 38.61,94.74 38.59,94.73 U17.2 38.59,91.06 34.54,91.06 33.65,90.17 33.65,85.98 ; C23.2 30.79,51.06 26.32,51.06 ; C23.2 C25.2 C22.2 C24.1 C21.1 ; C23.2 32.51,49.34 v1(32.51,47.75) ; R8.2 10.29,55 ; 10.29,55 10.29,57.92 R18.2 R19.2 18.42,63.38 19.81,64.77 U18.8 21.99,67.42 ; 10.29,55 10.29,48.01 ; 10.29,32.21 10.29,32.21 U1.19 21.93,32.21 23.11,33.4 23.11,35.18 U1.13 ; 10.29,32.21 10.29,36.33 ; SW1.4 26.32,51.06 ; 26.32,51.06 v1(26.32,54.83) ; 25.27,83.57 31.24,83.57 33.65,85.98 ; 25.27,83.57 25.97,84.26 U15.4 25.91,85.57 25.91,87.38 24.89,88.39 22.1,88.39 22.16,88.45 U15.16 ; 25.27,83.57 10.03,83.57 9.4,84.2 R25.2 9.39,84.72 8.51,85.6 8.51,86.92 H2.8 ; 21.99,67.42 33.39,67.42 35.69,69.72 35.69,77.12 R24.2 35.63,84.01 33.65,85.98 ; 21.99,67.42 21.97,67.41 v1(21.97,65.53) ; U1.64 43.3,33.21 43.31,33.21 ; 8.13,45.86 8.14,45.86 10.29,48.01 ; 10.29,36.33 R4.2 ; 10.29,36.33 10.29,48.01 ; 43.31,47.38 43.31,55 R16.2 ; 43.31,47.38 43.31,45.46 ; 43.31,47.38 R14.2 ; 43.31,33.21 43.31,23.63 R10.2 ; U1.48 29.15,16.94 26.54,14.34 CN2.10 CN2.9 CN2.8 21.95,13.84 v1(19.94,13.84)
  Inner1 w0.254: v1(26.32,54.83) 26.32,61.18 v1(21.97,65.53) ; v1(32.51,47.75) 34.8,45.47 v1(42.16,45.47)
  Inner2 w0.254: v1(10.67,22.22) 11.56,22.22 v1(19.94,13.84)
5V: length 198.7
  Top Layer w0.254: v1(34.16,13.97) CN2.16 CN2.15 CN2.14 ; U16.1 27.78,94.27 v1(28.7,93.34) ; 35.88,89.57 36.56,88.89 C18.2 36.58,87.36 v1(36.58,84.58)
  Inner1 w0.254: H5.1 9.14,82.68 12.95,86.49 15.37,86.49 21.34,92.46 27.81,92.46 v1(28.7,93.34)
  Inner2 w0.254: H2.10 v1(3.49,81.34)
  Bottom Layer w0.254: 42.93,78.23 v1(36.58,84.58) ; 42.93,78.23 42.93,90.68 42.42,91.19 42.93,91.69 42.93,92.2 41.78,93.34 v1(28.7,93.34) ; 42.93,78.23 42.93,70.23 ; v1(34.16,13.97) 51.05,13.97 52.96,15.88 52.96,59.44 51.82,60.58 48.18,60.58 H4.1 42.93,65.83 42.93,70.23 ; v1(3.49,81.34) 5.86,81.34 H5.1 11.22,78.06 12.32,76.96 12.32,72.22 H6.1 ; 42.93,70.23 44.75,72.06 H3.1
12V: length 247.9
  Top Layer w0.254: C11.1 46.99,29.91 ; 46.99,29.91 C12.1 ; 46.99,29.91 46.99,31.24 v1(46.99,31.24) ; v1(46.99,42.29) 46.99,40.95 C13.1 46.95,40.98 C14.1 ; v1(46.99,54.74) 46.86,54.61 C15.1 47.94,53.98 U9.2 ; C2.1 8.7,18.35 C1.1 4.13,18.35 2.92,19.56 ; v1(39.24,9.53) CN2.20 CN2.21 CN2.22 ; v1(52.58,73.53) 52.58,76.84 49.66,79.76 44.58,79.76 39.88,75.06 39.88,68.83 36.7,65.66 v1(32.64,65.66) ; v1(45.21,54.23) 45.21,53.28 C16.1 ; U6.2 49.21,17.84 C9.1 C10.1 ; C8.1 C7.1 4.25,53.15 U5.2
  Inner1 w0.254: v1(45.21,54.23) 46.48,54.23 v1(46.99,54.74) ; v1(39.24,9.53) 41.4,9.53 43.69,11.81 v1(47.24,11.81)
  Inner2 w0.254: U7.2 50.55,31.24 v1(46.99,31.24) ; U8.2 50.55,42.29 v1(46.99,42.29) ; U9.2 47.75,57.15 v1(47.75,62.87) ; v1(47.24,11.81) 50.04,11.81 52.07,13.84 52.07,17.4 U6.2
  Bottom Layer w0.254: 5.46,29.08 5.46,22.1 2.92,19.56 ; 5.46,29.08 5.46,40.51 ; 5.46,29.08 U3.2 ; v1(32.64,65.66) 31.24,67.06 12.06,67.06 12.06,62.55 4,54.48 U5.2 5.46,51.94 5.46,40.51 ; U8.2 50.42,42.42 49.02,43.82 ; 5.46,40.51 U4.2 ; 49.02,43.82 49.02,52.07 U9.2 ; 49.02,43.82 49.02,32.77 ; U6.2 49.02,20.45 49.02,32.77 ; 49.02,32.77 U7.2 ; v1(52.58,73.53) 52.58,67.69 v1(47.75,62.87)
AGND: length 42.2
  Top Layer w0.254: 13.33,9.53 10.67,9.53 10.04,10.16 CN2.1 ; 13.33,9.53 13.85,10.04 CN2.4 13.85,15.24 R17.2 ; 13.33,9.53 17.27,9.53 ; 28.83,9.53 29.08,9.78 CN2.12 ; 28.83,9.53 30.1,9.53 ; 28.83,9.53 17.27,9.53 ; 17.27,9.53 17.65,9.91 17.65,11.79 CN2.7 ; 30.1,9.53 30.35,9.78 CN2.13 ; 30.1,9.53 34.67,9.53 35.43,10.29 CN2.17
GND: length 339
  Top Layer w0.254: v1(24.13,93.34) 25.18,94.39 U16.5 25.15,95.09 25.15,97.16 27.3,99.31 31.62,99.31 31.62,96.83 35.88,92.57 35.88,93.47 C17.2 37.15,97.09 38.48,98.43 49.28,98.43 H1.3 ; v1(33.53,32.51) 33.33,32.71 U1.63 ; U3.1 3.56,29.08 v1(4.45,28.19) 5.72,28.19 C3.2 6.67,29.02 C4.2 ; C16.2 44.83,51.49 v1(44.83,49.93) ; 2.97,40.56 2.98,40.58 ; 2.97,40.56 2.92,40.54 2.89,40.58 2.98,40.58 ; 2.97,40.56 U4.1 ; 2.98,40.58 6.22,40.58 C6.2 C5.2 ; 13.35,75.44 v1(10.8,75.44) ; 13.35,75.44 U18.4 U18.3 U18.2 U18.1 ; 13.35,75.44 v1(15.11,75.44) ; v1(21.28,84.47) 21.28,84.63 U15.1 ; R17.1 13.71,16.89 v1(11.05,16.89) 11.05,16.89 C2.2 8.7,16.95 C1.2 6.67,17.02 U2.1 ; v1(23.24,68.96) 23.79,69.51 LED1.2 ; v1(28.07,21.08) 28.65,21.67 U1.47 ; C23.1 C25.1 C22.1 C24.2 C21.2 32.39,59.5 v1(32.39,61.09) ; v1(25.27,33.02) 23.9,33.02 23.65,33.27 U1.12 ; C8.2 C7.2 3.11,51.75 U5.1 ; C11.2 46.99,28.51 C12.2 46.99,27.69 v1(47.5,27.18) ; v1(45.85,38.23) 44.92,39.16 C14.2 46.95,39.58 C13.2 ; v1(15.24,56.26) 15.24,57.41 R22.1 ; v1(22.99,40.13) 22.23,40.13 21.46,39.37 C20.1 ; C18.1 39.35,88.77 v1(41.66,88.77) ; C19.1 27.3,38.23 21.53,38.23 ; CN2.19 37.97,13.72 v1(36.96,14.73) 29.59,14.73 27.81,12.95 CN2.11 ; U6.1 50.35,16.45 C9.2 C10.2 ; C26.1 7.05,84.2 v1(6.1,84.2) ; U1.31 12.9,26.21 v1(11.81,27.31) ; v1(11.3,40.51) v1(11.3,33.92) 11.3,33.27 11.86,32.71 U1.18 ; v1(46.87,49.93) 46.87,51.49 C15.2
  Inner1 w0.254: v1(11.3,40.51) U4.1 ; v1(21.28,84.47) 15.11,78.31 v1(15.11,75.44) 19.18,75.44 23.24,71.37 v1(23.24,68.96) ; H1.3 42.67,88.77 v1(41.66,88.77) ; v1(6.1,84.2) 6.1,87.08 6.78,87.76 8.76,87.76 9.49,88.49 H2.4
  Inner2 w0.254: v1(47.5,27.18) 49.28,27.18 U7.1 ; v1(45.85,38.23) 49.02,38.23 U8.1 ; v1(22.99,40.13) 25.27,37.85 v1(25.27,33.02) ; v1(36.96,14.73) 48.64,14.73 U6.1
  Bottom Layer w0.254: v1(28.07,21.08) 24.64,17.65 11.81,17.65 ; v1(22.99,40.13) 16.89,40.13 14.35,42.67 14.35,55.37 v1(15.24,56.26) 20.45,56.26 25.27,61.09 v1(32.39,61.09) ; v1(11.81,27.31) 11.81,17.65 ; 11.81,17.65 v1(11.05,16.89) ; v1(33.53,32.51) 32.39,33.66 25.91,33.66 v1(25.27,33.02)
  vias: v1(1.14,41.78) v1(3.81,50.29) v1(9.14,61.09) v1(43.81,66.55) v1(43.94,74.68)
BOOT0: length 111.6
  Top Layer w0.254: U1.60 36.77,31.21 42.39,25.59 42.39,21.64 43.07,20.96 45.26,20.96 45.72,21.42 45.72,22.86 47.17,22.86 48.62,24.31 48.62,30.62 46.04,33.2 46.04,34.67 47.39,34.67 48.75,36.03 48.75,41.85 46.16,44.44 46.16,46.1 47.42,46.1 48.67,47.35 48.67,51.85 49.53,52.71 52.12,52.71 52.12,59.82 50.15,61.79 20.64,61.79 R22.2 16.5,55.17 SW1.1
DEBUG_RX: length 99.2
  Top Layer w0.254: v1(35.82,26.27) 35.37,26.71 U1.51
  Inner2 w0.254: H2.9 8.06,96.5 16.74,96.5 27.25,86 27.25,82.61 37.15,72.7 37.15,27.6 v1(35.82,26.27)
DEBUG_TX: length 99.9
  Top Layer w0.254: v1(35.82,27.96) 35.08,27.21 U1.52
  Bottom Layer w0.254: H2.7 4.43,92.99 2.88,92.99 1.48,91.59 1.48,90.28 4.6,87.15 25.21,87.15 33.33,79.04 33.33,45.24 35.82,42.74 v1(35.82,27.96)
DS18B20: length 319.7
  Top Layer w0.254: U1.20 24.05,31.71 25.75,30.02 25.75,29.37 23.62,27.24 v1(23.62,27.18) ; H1.2 48.26,87.81 53.29,82.78 53.29,15.91 39.55,2.17 10.14,2.17 0.51,11.81 0.51,36.25 2.87,38.61 8.51,38.61 9.78,39.88 9.78,42.93 7.37,45.34 7.37,46.23 6.98,46.61 5.84,46.61 4.86,47.59 4.86,47.97 2.54,50.29 1.78,50.29 1.02,51.05 1.02,62.99 8.37,70.35 18.8,70.35 25.64,77.18 R24.1 34.12,74.38 v1(34.51,73.99)
  Inner2 w0.254: v1(34.51,73.99) 34.51,30.57 28.11,24.17 26.63,24.17 v1(23.62,27.18)
EEPROM_SCL: length 57
  Top Layer w0.254: v1(28.32,31.37) 28.67,31.71 U1.61 ; 17.27,66.17 17.02,65.91 v1(16.51,65.91) ; 17.27,66.17 U18.6 ; 17.27,66.17 17.65,65.79 17.65,64.9 17.65,64.9 17.65,64.89 R19.1
  Bottom Layer w0.254: v1(28.32,31.37) 17.14,31.37 12.95,35.56 12.95,65.02 13.84,65.91 v1(16.51,65.91)
EEPROM_SDA: length 54.1
  Top Layer w0.254: U18.5 15.22,67.42 14.86,67.06 14.86,65.78 15.74,64.9 ; U1.62 28.62,32.21 v1(28.45,32.39) ; 15.74,64.9 v1(13.72,64.9) ; 15.74,64.9 R18.1
  Bottom Layer w0.254: v1(13.72,64.9) 13.72,35.43 16.76,32.39 v1(28.45,32.39)
FB_FAN1: length 36.2
  Top Layer w0.254: v1(9.52,26.54) 8.64,25.65 R2.1 ; v1(29.02,29.75) 29.48,30.21 U1.58 ; R1.2 5.09,23.74 v1(4.74,23.4)
  Inner1 w0.254: v1(4.74,23.4) 6.38,23.4 v1(9.52,26.54) 28.59,26.54 29.02,26.97 v1(29.02,29.75)
FB_FAN2: length 109.3
  Top Layer w0.254: U1.59 36.47,30.71 41.78,25.4 41.78,18.42 43.31,16.89 43.31,11.3 36.27,4.26 9.83,4.26 1.4,12.7 1.4,25.07 3.19,26.86 8.7,26.86 9.78,27.94 9.78,31.62 7.75,33.66 7.75,35.3 R4.1 R3.2
FB_FAN3: length 40.7
  Top Layer w0.254: v1(29.66,28.91) 29.66,26.21 U1.50 ; v1(8.13,49.56) R6.1 6.49,47.37 R5.2
  Inner2 w0.254: v1(8.13,49.56) 23.98,33.72 23.98,29.24 24.31,28.91 v1(29.66,28.91)
FB_FAN4: length 56.4
  Top Layer w0.254: v1(32.89,29.85) 32.89,29.08 32.52,28.71 U1.55 ; v1(6.66,49.1) 7.99,50.42 8.89,50.42 9.78,51.31 9.78,53.85 7.24,56.39 7.24,58.03 R8.1 R7.2
  Bottom Layer w0.254: v1(6.66,49.1) 6.66,40.58 16.65,30.6 32.14,30.6 v1(32.89,29.85)
FB_FAN5: length 34.6
  Top Layer w0.254: R10.1 R9.2 47.12,24.12 v1(47.12,26.16) ; U1.22 23.9,30.71 v1(24.89,29.72)
  Inner1 w0.254: v1(47.12,26.16) 42.68,30.6 25.77,30.6 v1(24.89,29.72)
FB_FAN6: length 37.3
  Top Layer w0.254: v1(22.1,27.18) 22.1,29.34 21.22,30.21 U1.23 ; R11.2 R12.1 v1(45.08,37.59)
  Inner1 w0.254: v1(45.08,37.59) 30.96,37.59 22.1,28.73 v1(22.1,27.18)
FB_FAN7: length 64.2
  Top Layer w0.254: 45.85,46.85 R14.1 ; 45.85,46.85 45.85,57.4 42.2,57.4 38.56,53.76 38.56,50.31 31.47,43.22 17.1,43.22 14.73,40.86 14.73,39.24 17.35,36.63 22.65,36.63 U1.14 ; 45.85,46.85 R13.2
FB_FAN8: length 44.1
  Top Layer w0.254: v1(43.19,58.14) 43.21,58.16 R16.1 R15.2 ; U1.15 22.15,33.8 20.36,33.8 v1(19.94,34.23)
  Inner1 w0.254: v1(19.94,34.23) 19.94,40.38 37.69,58.14 v1(43.19,58.14)
LIVE_LED: length 41.4
  Top Layer w0.254: R23.1 31.16,70.61 v1(31.6,70.17) ; v1(32.15,36.37) 31.94,36.58 28.65,36.58 U1.2
  Inner2 w0.254: v1(31.6,70.17) 31.6,36.92 v1(32.15,36.37)
NRST: length 95.2
  Top Layer w0.254: 14.01,88.68 14.01,91.78 11.4,94.39 8.89,94.39 7.49,92.99 ; 14.01,88.68 11.55,86.22 R25.1 ; 14.01,88.68 14.01,85.64 v1(13.97,85.6) ; C26.2 5.58,86.17 2.17,89.58 2.17,92.99 7.49,92.99 ; 7.49,92.99 H2.5 ; v1(24.26,37.08) 25.53,37.08 26.16,36.45 26.16,35.23 U1.7
  Inner1 w0.254: v1(21.46,44.7) 19.94,44.7 12.19,52.45 12.19,83.82 v1(13.97,85.6)
  Bottom Layer w0.254: v1(21.46,44.7) 24.26,41.91 v1(24.26,37.08)
PWM_FAN1: length 30.3
  Top Layer w0.254: U1.41 25.65,21.59 24.26,20.19 8.76,20.19 7.68,21.27 7.68,24.96 6.98,25.65 3.94,25.65 U2.4
PWM_FAN2: length 52.3
  Top Layer w0.254: U1.44 27.15,21.18 v1(27.05,21.08) ; U3.4 1.27,35.05 v1(1.27,34.42)
  Inner1 w0.254: v1(1.27,34.42) 1.27,16 1.71,15.56 21.53,15.56 v1(27.05,21.08)
PWM_FAN3: length 34.7
  Top Layer w0.254: v1(17.27,29.08) 17.27,28.07 18.12,27.21 U1.29 ; v1(1.13,45.94) 1.13,46.34 U4.4
  Inner1 w0.254: v1(1.13,45.94) 1.13,45.43 2.23,44.32 9.91,44.32 17.27,36.96 v1(17.27,29.08)
PWM_FAN4: length 46.3
  Top Layer w0.254: v1(16,29.08) 16,28.32 17.61,26.71 U1.30
  Inner1 w0.254: U5.4 4.39,59.56 18.72,45.24 18.72,29.01 18.06,28.35 16.74,28.35 v1(16,29.08)
PWM_FAN5: length 69.8
  Top Layer w0.254: v1(13.21,30.99) 16.69,30.99 18.33,29.35 18.33,28.71 U1.26
  Inner1 w0.254: U6.4 17.64,24.13 14.01,20.5 6.79,20.5 4.12,23.18 4.12,24.63 10.48,30.99 v1(13.21,30.99)
PWM_FAN6: length 69.1
  Top Layer w0.254: v1(21.34,28.96) 20.59,28.21 U1.27 ; U7.4 52.83,34.04 52.83,16.51 49.28,12.95 v1(45.21,12.95)
  Inner1 w0.254: v1(19.3,22.1) 36.07,22.1 v1(45.21,12.95)
  Bottom Layer w0.254: v1(21.34,28.96) 21.34,24.56 19.3,22.53 v1(19.3,22.1)
PWM_FAN7: length 93.3
  Top Layer w0.254: U1.16 17.74,35.21 13.24,39.72 13.24,58.03 17.66,62.44 36.15,62.44 44.38,70.68 45.78,70.68 52.76,63.7 52.76,49.58 U8.4
PWM_FAN8: length 66.2
  Top Layer w0.254: v1(16.3,34.28) 17.36,33.21 U1.17 ; v1(48.61,58.55) 49.12,59.06 U9.4
  Inner1 w0.254: v1(48.61,58.55) 43.18,53.11 33.69,53.11 20.74,40.16 20.74,30.26 17.68,27.21 16.12,27.21 14.3,29.03 14.3,32.27 v1(16.3,34.28)
RGB1: length 92.5
  Top Layer w0.254: H3.2 47.31,74.06 v1(48.32,75.07) ; v1(20.95,22.86) 21.72,22.1 23.37,22.1 23.62,22.35 23.62,23.69 U1.37
  Inner1 w0.254: v1(20.95,22.86) 51.11,22.86 52.63,24.39 52.63,70.76 v1(48.32,75.07)
RGB2: length 69.1
  Top Layer w0.254: v1(48.32,65.2) 48.23,65.29 H4.2 ; v1(24.16,25.32) 24.15,25.31 U1.38
  Inner1 w0.254: v1(24.16,25.32) 47.54,25.32 49.05,26.82 49.05,55.07 49.48,55.51 49.48,64.04 v1(48.32,65.2)
RGB3: length 74.3
  Top Layer w0.254: v1(20.29,24.91) 20.29,22.25 20.97,21.58 23.99,21.58 24.65,22.24 U1.39 ; H5.2 8.05,76.06 v1(6.95,74.95)
  Inner2 w0.254: v1(20.29,24.91) 9.99,24.91 5.8,29.09 5.8,73.81 v1(6.95,74.95)
RGB4: length 51.6
  Top Layer w0.254: H6.2 10.03,67.04 v1(10.59,66.49) ; v1(26.51,29.75) 26.51,27.75 25.15,26.39 U1.40
  Inner2 w0.254: v1(10.59,66.49) 10.59,57.96 26.51,42.04 v1(26.51,29.75)
SYS_RXD: length 81.2
  Top Layer w0.254: v1(30.35,80.52) 28.32,82.55 R20.2 ; U1.42 26.15,20.59 26.69,20.04 v1(28.45,20.04)
  Inner2 w0.254: v1(28.45,20.04) 30.81,20.04 38.31,27.54 38.31,72.57 v1(30.35,80.52)
SYS_TXD: length 68.1
  Top Layer w0.254: v1(27.56,33.02) 27.56,26.47 26.65,25.56 U1.43 ; R21.2 23.37,79.79 v1(23.74,79.42)
  Inner2 w0.254: v1(23.74,79.42) 23.74,71.45 31.07,64.12 31.07,36.07 31.34,35.79 31.34,32.68 29.26,30.6 28.07,30.6 27.56,31.11 v1(27.56,33.02)
TCK/CK: length 85.3
  Top Layer w0.254: H2.2 11.56,89.87 v1(11.56,88.01) ; v1(28.32,27.56) 28.32,26.42 29.02,25.71 U1.49
  Inner2 w0.254: v1(28.32,27.56) 28.02,27.86 14.67,27.86 7.4,35.13 7.4,69.37 8.57,70.55 9.33,70.55 11.56,72.77 v1(11.56,88.01)
TMS/IO: length 106.9
  Top Layer w0.254: v1(8.11,88.51) 8.11,89.31 H2.6 ; U1.46 28.15,25.27 29.34,25.27 29.73,24.88 29.73,15.91 v1(27.36,13.53)
  Inner2 w0.254: v1(8.11,88.51) 4.75,85.15 4.75,29.54 10.05,24.24 14.32,24.24 25.03,13.53 v1(27.36,13.53)
WP: length 45.4
  Top Layer w0.254: v1(18.89,65.59) 18.89,67.08 U18.7 ; v1(30.53,35.16) 29.15,33.78 24.51,33.78 24.15,34.14 U1.11
  Inner2 w0.254: v1(30.53,35.16) 30.53,53.94 v1(18.89,65.59)
$1N3735: length 3.9
  Top Layer w0.254: R1.1 6.6,22.1 U2.3
$1N4374: length 3.9
  Top Layer w0.254: U3.3 6.09,34.16 R3.1
$1N5683: length 3.7
  Top Layer w0.254: R5.1 6.21,45.59 U4.3
$1N5690: length 3.5
  Top Layer w0.254: U5.3 6.09,57.02 R7.1
$1N10521: length 4
  Top Layer w0.254: R9.1 47.13,21.59 U6.3
$1N10528: length 3.8
  Top Layer w0.254: U7.3 47.25,33.66 R11.1
$1N10535: length 3.8
  Top Layer w0.254: U8.3 47.38,44.96 R13.1
$1N10542: length 4.2
  Top Layer w0.254: R15.1 46.87,56.52 U9.3
$1N19138: length 9.9
  Top Layer w0.254: U16.3 26.57,94.97 26.57,86.19 U15.5
$1N19241: length 17.9
  Top Layer w0.254: U15.6 28.51,86.27 32.73,90.5 32.73,94.14 30.56,96.31 27.48,96.31 27.13,95.96 U16.2
$1N20833: length 74.2
  Top Layer w0.254: U15.3 24.35,85.51 24.35,87.86 19,87.86 19,98.07 0.78,98.07 0.78,86.98 5.97,81.79 24.15,81.79 R20.1
$1N20835: length 65.5
  Top Layer w0.254: R21.1 6.36,82.54 1.4,87.5 1.4,96.23 15.9,96.23 15.9,87.32 23.43,87.32 U15.2
$1N25627: length 8.1
  Top Layer w0.254: X1.1 28.83,38.11 C19.2 28.83,37.47 28.45,37.08 27.3,37.08 27.15,36.93 U1.5
$1N25686: length 13
  Top Layer w0.254: U1.6 26.65,36.72 25.65,37.72 23.75,37.72 23.11,37.08 21.21,37.08 C20.2 20.06,41.78 X1.2
$1N30814: length 2.3
  Top Layer w0.254: LED1.1 R23.2

## Copper pours and planes (outline as drawn; the poured copper is in the pictures)
12V on Top Layer: -3.43,105.54 56.9,105.54 56.9,-1.65 -3.43,-1.65
12V on Inner1: -6.1,107.44 61.47,107.44 61.47,-4.44 -6.1,-4.44
GND on Bottom Layer: -8.89,109.09 64.77,109.09 64.77,-7.62 -8.89,-7.62
